# Altium schematic sheet Dual in Dual Out Scaling Op-Amps.SchDoc
size A
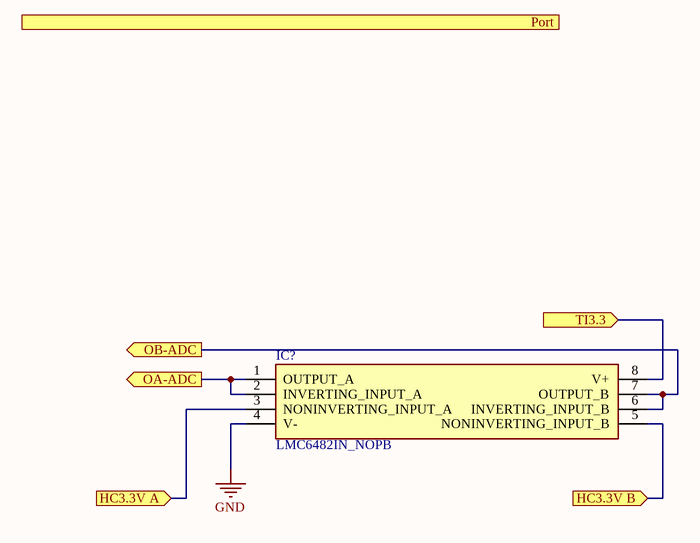
[diagram p0: Dual in Dual Out Scaling Op-Amps.SchDoc]

## Parts
IC?  LMC6482IN_NOPB  [DIP794W53P254L959H508Q8N]

## Ports
HC3.3V A (in), HC3.3V B (in), OA-ADC (out), OB-ADC (out), Port, TI3.3 (in)

## Nets
GND: IC?.4(V-)
HC3.3V A: IC?.3(NONINVERTING_INPUT_A) ; port HC3.3V A
HC3.3V B: IC?.5(NONINVERTING_INPUT_B) ; port HC3.3V B
OA-ADC: IC?.1(OUTPUT_A) IC?.2(INVERTING_INPUT_A) ; port OA-ADC
OB-ADC: IC?.6(INVERTING_INPUT_B) IC?.7(OUTPUT_B) ; port OB-ADC
TI3.3: IC?.8(V+) ; port TI3.3

## Library data of the parts
IC? = LMC6482IN_NOPB: Integrated Circuit; Manufacturer_Name: Texas Instruments; Manufacturer_Part_Number: LMC6482IN/NOPB; Datasheet Link: http://www.ti.com/lit/gpn/lmc6482; Height: 5.08mm; Mouser Part Number: 926-LMC6482IN/NOPB; Mouser Price/Stock: https://www.mouser.co.uk/ProductDetail/Texas-Instruments/LMC6482IN-NOPB?qs=QbsRYf82W3EByDDrj8Vijg%3D%3D; Arrow Part Number: LMC6482IN/NOPB; Arrow Price/Stock: https://www.arrow.com/en/products/lmc6482innopb/texas-instruments?region=nac